# Altium schematic sheet Sheet1.SchDoc
size A4
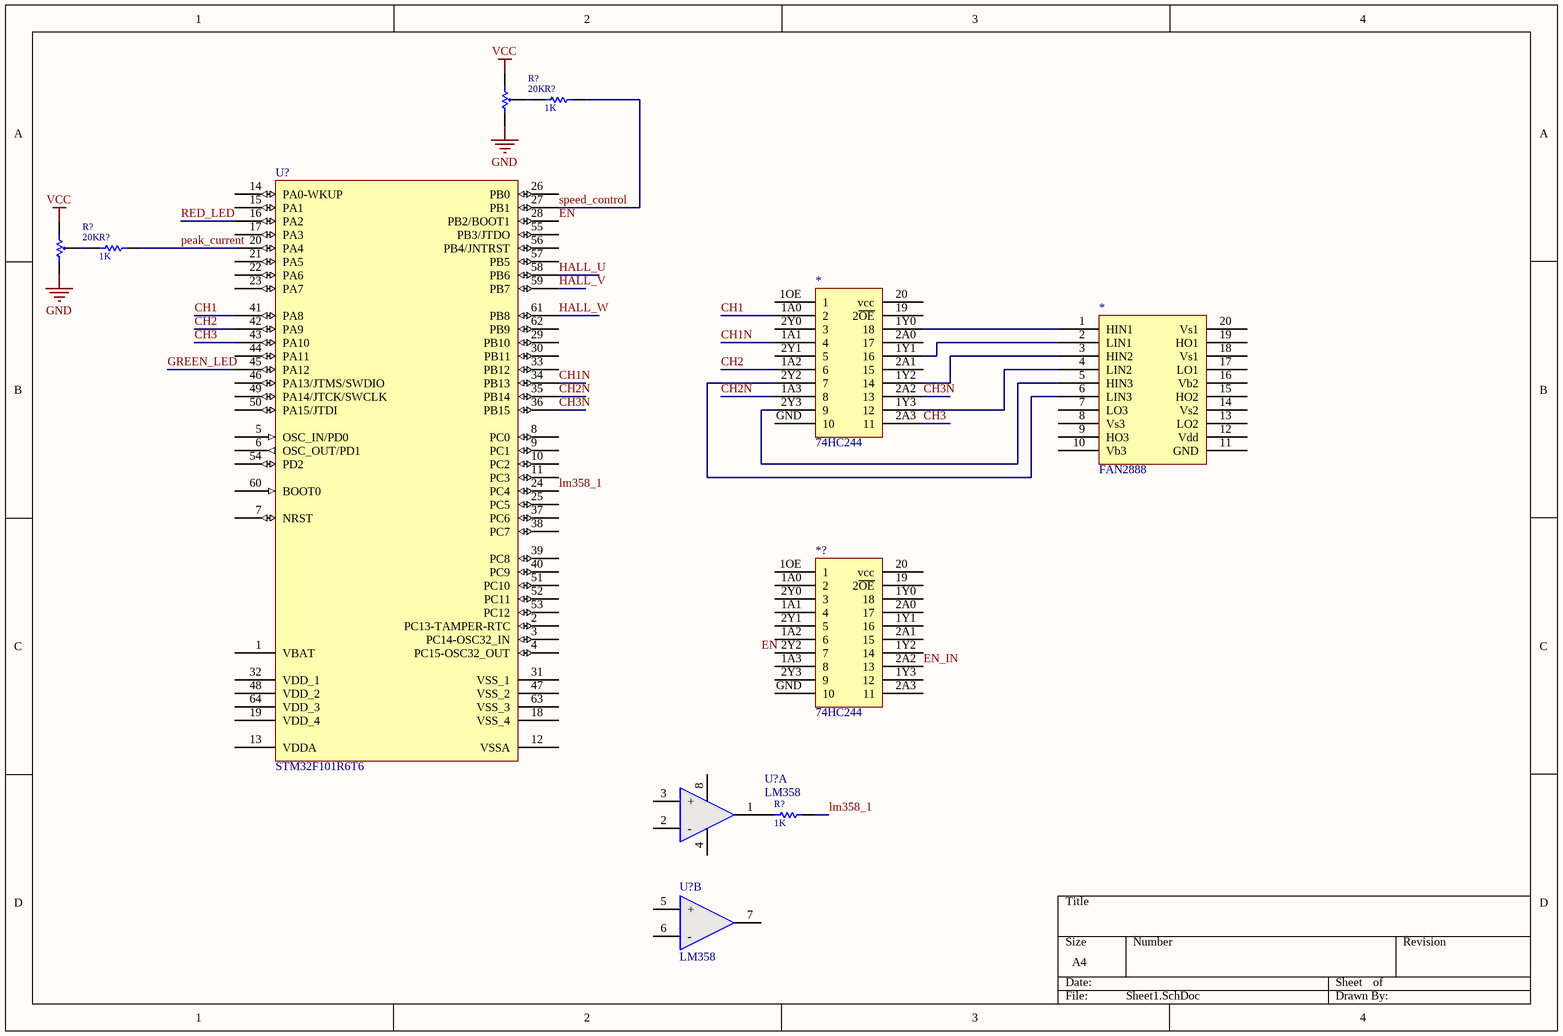
[diagram p0: Sheet1.SchDoc]

## Parts
(Parts that share a designator on the sheet are numbered #1, #2 ... from top to bottom, then left to right.)
*#1  74HC244
*#2  FAN2888
*?  74HC244
R?#1  20K  [RES_3362P]
R?#2  1K  [R0603]
R?#3  20K  [RES_3362P]
R?#4  1K  [R0603]
R?#5  1K  [R0603]
U?#1  STM32F101R6T6  [LQFP64_N]
U?#2  LM358  [NSO8_N]  (part A of 2)
U?#3  LM358  [NSO8_N]  (part B of 2)

## Nets
GND: R?#1.1 R?#3.1
VCC: R?#1.3 R?#3.3
CH1: *#1.1A0(2) U?#1.41(PA8)
CH1N: *#1.1A1(4) U?#1.34(PB13)
CH2: *#1.1A2(6) U?#1.42(PA9)
CH2N: *#1.1A3(8) U?#1.35(PB14)
CH3: *#1.2A3(11) U?#1.43(PA10)
CH3N: *#1.2A2(13) U?#1.36(PB15)
EN: U?#1.28(PB2/BOOT1)
EN_IN: *?.2A2(13)
GREEN_LED: U?#1.45(PA12)
HALL_U: U?#1.58(PB6)
HALL_V: U?#1.59(PB7)
HALL_W: U?#1.61(PB8)
lm358_1: R?#5.1 U?#1.24(PC4)
peak_current: R?#4.1 U?#1.20(PA4)
RED_LED: U?#1.16(PA2)
speed_control: R?#2.1 U?#1.27(PB1)
Net*#1_1Y0: *#1.1Y0(18) *#2.1(HIN1)
Net*#1_1Y1: *#1.1Y1(16) *#2.2(LIN1)
Net*#1_1Y2: *#1.1Y2(14) *#2.3(HIN2)
Net*#1_1Y3: *#1.1Y3(12) *#2.4(LIN2)
Net*#1_2Y2: *#1.2Y2(7) *#2.6(LIN3)
Net*#1_2Y3: *#1.2Y3(9) *#2.5(HIN3)
NetR?#1_2: R?#1.2 R?#2.2
NetR?#3_2: R?#3.2 R?#4.2
NetR?#5_2: R?#5.2 U?#2.1(OUT1)

Not connected (* = marked no-connect by the designer): *#1 1OE(1) 2A0(17) 2A1(15) 2Y0(3) 2Y1(5) 19(2~{OE}) 20(vcc) GND(10); *#2 7(LO3) 8(Vs3) 9(HO3) 10(Vb3) 11(GND) 12(Vdd) 13(LO2) 14(Vs2) 15(HO2) 16(Vb2) 17(LO1) 18(Vs1) 19(HO1) 20(Vs1); *? 1A0(2) 1A1(4) 1A2(6) 1A3(8) 1OE(1) 1Y0(18) 1Y1(16) 1Y2(14) 1Y3(12) 2A0(17) 2A1(15) 2A3(11) 2Y0(3) 2Y1(5) 2Y2(7) 2Y3(9) 19(2~{OE}) 20(vcc) GND(10); U?#1 1(VBAT) 2(PC13-TAMPER-RTC) 3(PC14-OSC32_IN) 4(PC15-OSC32_OUT) 5(OSC_IN/PD0) 6(OSC_OUT/PD1) 7(NRST) 8(PC0) 9(PC1) 10(PC2) 11(PC3) 12(VSSA) 13(VDDA) 14(PA0-WKUP) 15(PA1) 17(PA3) 18(VSS_4) 19(VDD_4) 21(PA5) 22(PA6) 23(PA7) 25(PC5) 26(PB0) 29(PB10) 30(PB11) 31(VSS_1) 32(VDD_1) 33(PB12) 37(PC6) 38(PC7) 39(PC8) 40(PC9) 44(PA11) 46(PA13/JTMS/SWDIO) 47(VSS_2) 48(VDD_2) 49(PA14/JTCK/SWCLK) 50(PA15/JTDI) 51(PC10) 52(PC11) 53(PC12) 54(PD2) 55(PB3/JTDO) 56(PB4/JNTRST) 57(PB5) 60(BOOT0) 62(PB9) 63(VSS_3) 64(VDD_3); U?#2 2(-) 3(+) 4(V-) 8(V+); U?#3 5(+) 6(-) 7(OUT2)

## Notes on the sheet
- Labels drawn without touching a wire or pin: EN

## Library data of the parts
R?#1 R?#3 = RES_ADJ: 贴片电阻; Manufacturer: BOURNS; PartNumber: 3362P-1-203LF; Welding: SMT; Value: 20KΩ ±10% ±100ppm/℃; 10nc: *
R?#2 R?#4 R?#5 = RES: 贴片电阻; Manufacturer: Yageo; PartNumber: RC0603FR-0710KL; Welding: SMT; Value: 10KΩ_±1%_0603; 10nc: *
U?#1 = STM32F101R6T6: STM32 ARM-based 32-bit MCU with 32 Kbytes Flash, 64-pin LQFP, Industrial Temperature; Published: 30-May-2008; DatasheetVersion: rev6, Mar-2008; PackageVersion: Mar-2008; PackageReference: LQFP64; Publisher: Altium Limited; PackageDescription: 64-Pin Low-Profile Quad Flat Pack, 10 x 10 mm Body, 0.5 mm Pitch (LQFP64); ComponentLink1Description: Manufacturer Link; ComponentLink1URL: www.st.com/stm32; ComponentLink2Description: Datasheet; ComponentLink2URL: http://www.st.com/stonline/products/literature/ds/13586.pdf
U?#2 U?#3 = LM358: 双运放